# Altium schematic sheet DISPLAY.SchDoc
size A; SheetNumber: 3; SheetTotal: 7
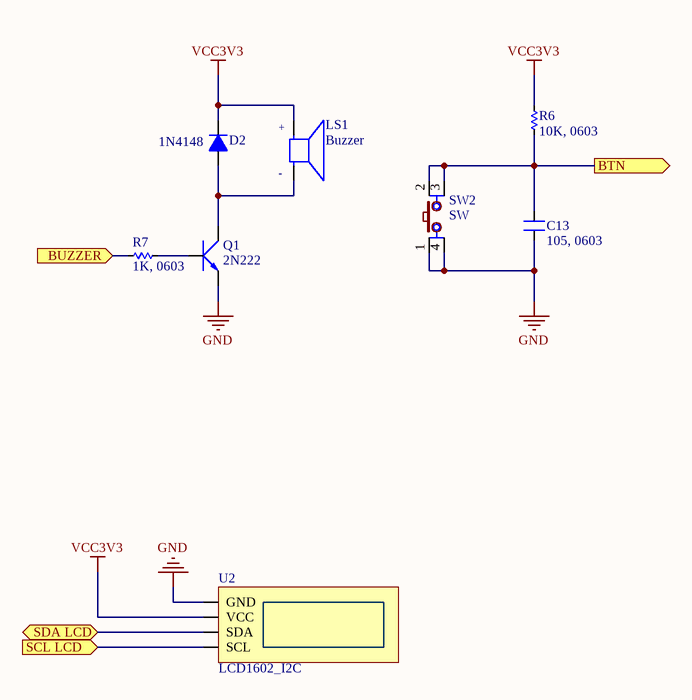
[diagram p0: DISPLAY.SchDoc]

## Parts
C13  105, 0603  [SM-0603]
D2  1N4148  [D0.5A]
LS1  Buzzer  [XDCR_AI-1027-TWT-3V-R]
Q1  2N222  [TO92-123]
R6  10K, 0603  [RES-SMD-0603]
R7  1K, 0603  [RES-SMD-0603]
SW2  SW  [SW2-SMD]
U2  LCD1602_I2C

## Ports
BTN (out), BUZZER (in), SCL LCD (in), SDA LCD (bidir)

## Nets
GND: C13.1 Q1.1(E) SW2.1 SW2.4 U2.1(GND)
VCC3V3: D2.2(K) LS1.P R6.2 U2.2(VCC)
BTN: C13.2 R6.1 SW2.2 SW2.3 ; port BTN
BUZZER: R7.2 ; port BUZZER
SCL LCD: U2.4(SCL) ; port SCL LCD
SDA LCD: U2.3(SDA) ; port SDA LCD
NetD2_1: D2.1(A) LS1.N Q1.3(C)
NetQ1_2: Q1.2(B) R7.1

## Notes on the sheet
- (in symbol AI-1027-TWT-3V-R) +; -

## Library data of the parts
C13 = CM: Cap SMD; Value: 103
D2 = D0.5A: Value: 1N4148
LS1 = AI-1027-TWT-3V-R: MF: {'manufacturer': u'PUI Audio,'}; Package: None; Price: None; Value: *; MP: AI-1027-TWT-3V-R; Availability: Unavailable
Q1 = 2N222: NPN 600mW, ECB; Value: C1815
R6 R7 = Res-SMD: Resistor; Manufacturer: Generic Components; Class: Passive; Published: 08/06/2000; Publisher: Altium Hobart Technology Centre
SW2 = SW4: Switch button 4 pin; Value: Button chip 4 pin
U2 = LCD1602_I2C: Module LCD1602 I2C